# Altium schematic sheet bno_aux.SchDoc
size A
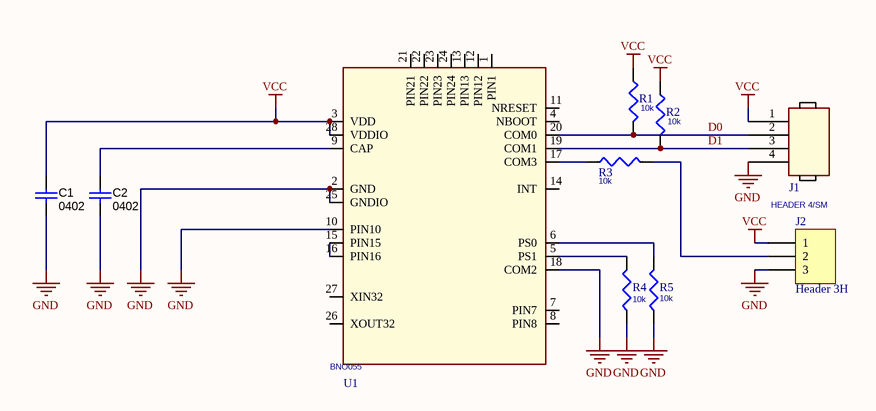
[diagram p0: bno_aux.SchDoc]

## Parts
C1  Cap_Case: 0402  [CAPC0402N]  (hidden comment: 885012205037)
C2  Cap_Case: 0402  [CAPC0402N]  (hidden comment: 885012205037)
J1  HEADER 4/SM  [61900411021]
J2  Header 3H  [SolderJumper]
R1  10k  [RESC402N]
R2  10k  [RESC402N]
R3  10k  [RESC402N]
R4  10k  [RESC402N]
R5  10k  [RESC402N]
U1  BNO055  [LCCS50P520X380X118-28N]

## Nets
GND: C1.2 C2.2 J1.4 J2.3 R4.1 R5.1 U1.2(GND) U1.10(PIN10) U1.18(COM2) U1.25(GNDIO)
VCC: C1.1 J1.1 J2.1 R1.1 R2.1 U1.3(VDD) U1.28(VDDIO)
D0: J1.2 R1.2 U1.20(COM0)
D1: J1.3 R2.2 U1.19(COM1)
NetC2_1: C2.1 U1.9(CAP)
NetJ2_2: J2.2 R3.2
NetR3_1: R3.1 U1.17(COM3)
NetR4_2: R4.2 U1.5(PS1)
NetR5_2: R5.2 U1.6(PS0)
NetU1_15: U1.15(PIN15) U1.16(PIN16)

Not connected (* = marked no-connect by the designer): U1 1(PIN1) 4(NBOOT) 7(PIN7) 8(PIN8) 11(NRESET) 12(PIN12) 13(PIN13) 14(INT) 21(PIN21) 22(PIN22) 23(PIN23) 24(PIN24) 26(XOUT32) 27(XIN32)

## Library data of the parts
C1 C2 = 885012205037: CAP, CERM, 0.1 µF, 16 V, +/- 10%, X7R, 0402; Manufacturer: Wurth Elektronik; Polarized: N; CompType: Capacitor; Value: 0.1uF; ValueDisplayed: 0.1µF; U/M: EA; Cap_F: 0.0000001; Tolerance_%: 10; Value1: Unknown; VDC_V: 16; Value2: 16V; TaMin_C: -55; TaMax_C: 125; AEC Category: Q200; SymbolVersion: 2008-07-09; PartNumber: 885012205037; PackageReference: 0402; RoHS: Y; MountType: SMT; Technology: Ceramic; TempCo: X7R; Published: 2008-06-19; Publisher: Texas Instruments; LatestRevisionDate: 2016-02-01; ComponentLink1Description: Datasheet link; ComponentLink1URL: http://katalog.we-online.de/pbs/datasheet/885012205037.pdf; Supplier 1: Digi-Key; Supplier Part Number 1: 732-7532-1-ND; Supplier 2: Mouser; Supplier Part Number 2: 710-885012205037; AEC Qualified: N; AEC Grade: N/A
J2 = Header 3H: Header, 3-Pin, Right Angle; LatestRevisionDate: 17-Jul-2002; LatestRevisionNote: Re-released for DXP Platform.; Publisher: Altium Limited
R1-R5 = RC0402FR-0710KL: RES SMD 10K OHM 1% 1/16W 0402